# EasyEDA Pro project RCKid.epro, schematic TestBoard

## Sheets
1 Audio: Board Name: TestBoard; Create Date: 2025-06-01; Page Name: Audio; Project Name: rckid; Schematic Name: TestBoard; Update Date: 2025-06-01; Company: EasyEDA.com; Page Size: A4; Version: V1.0
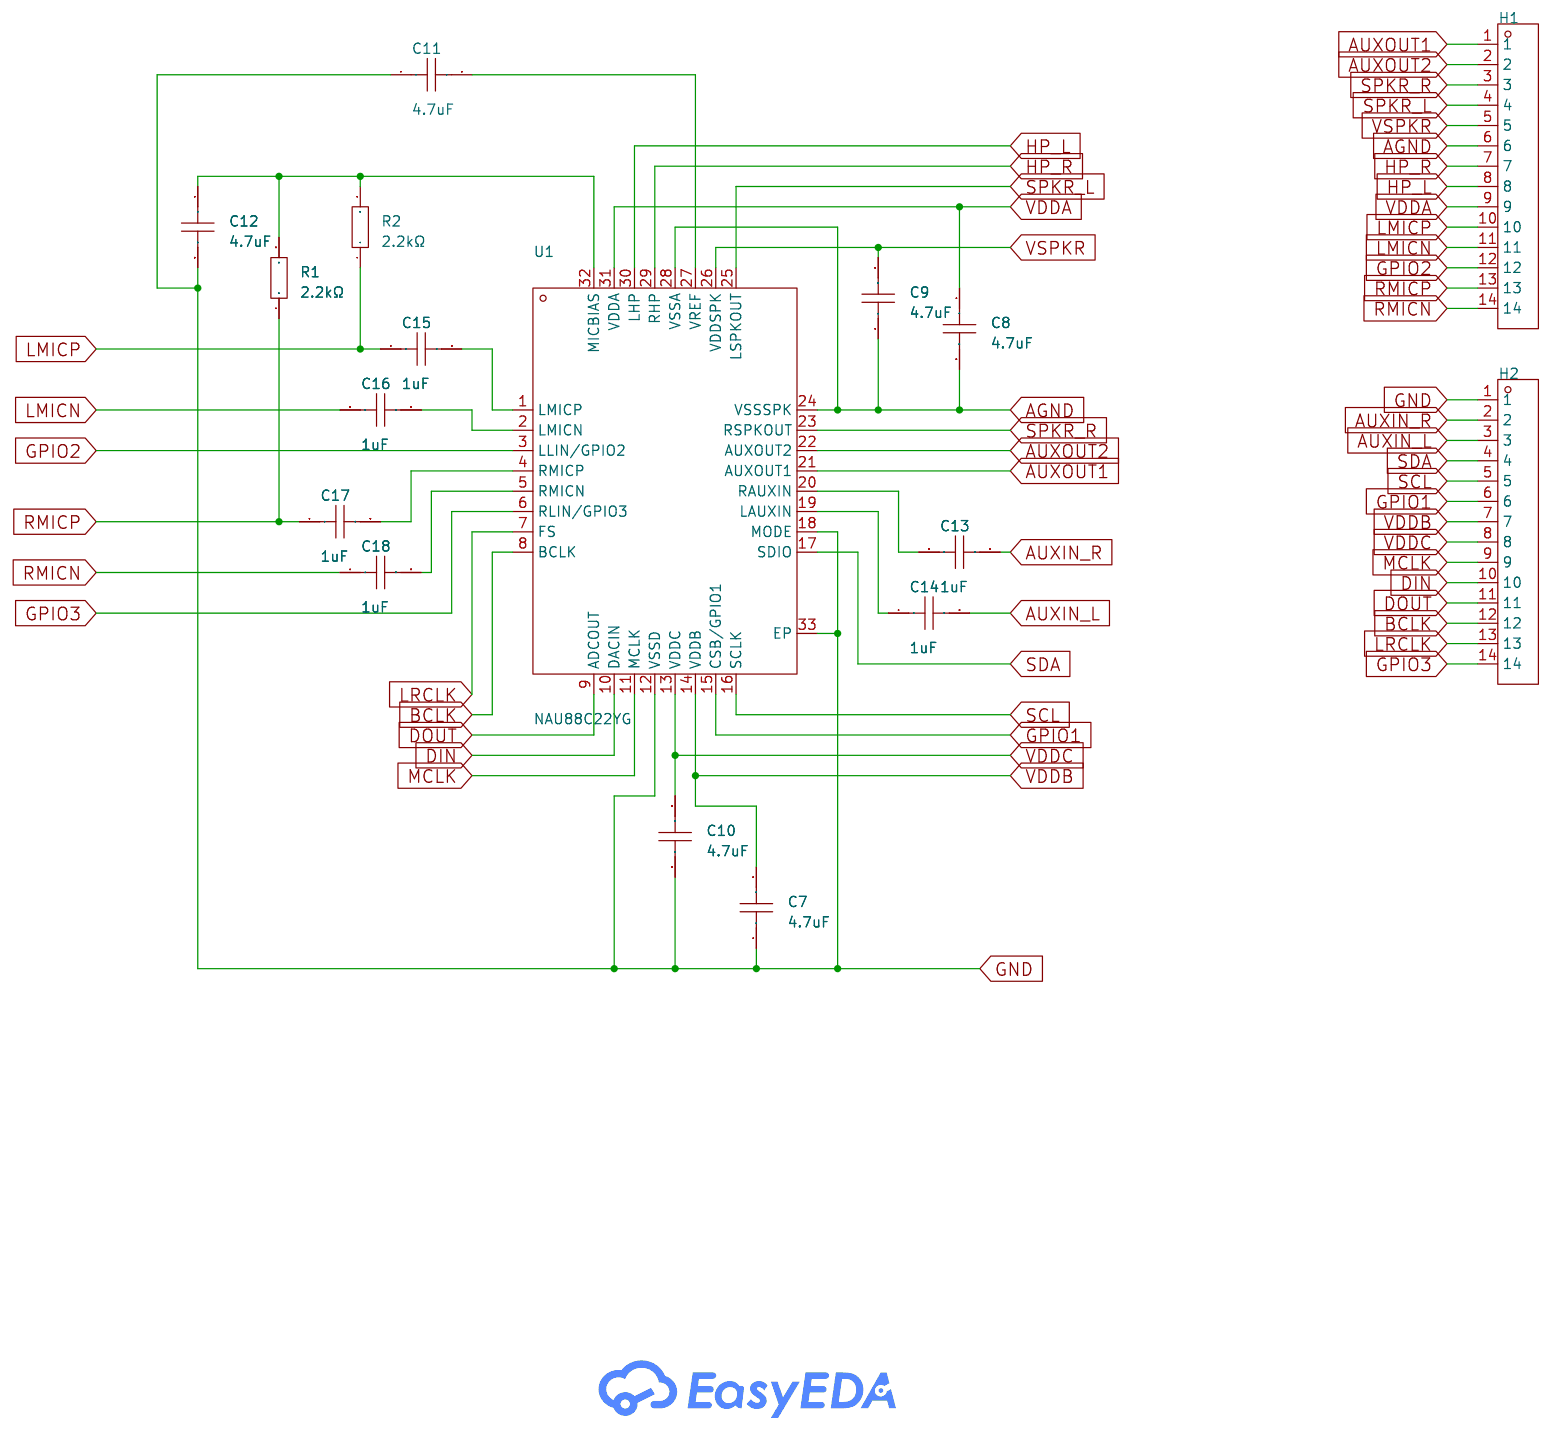
[diagram p9: Audio]
2 PMIC: Page Name: PMIC
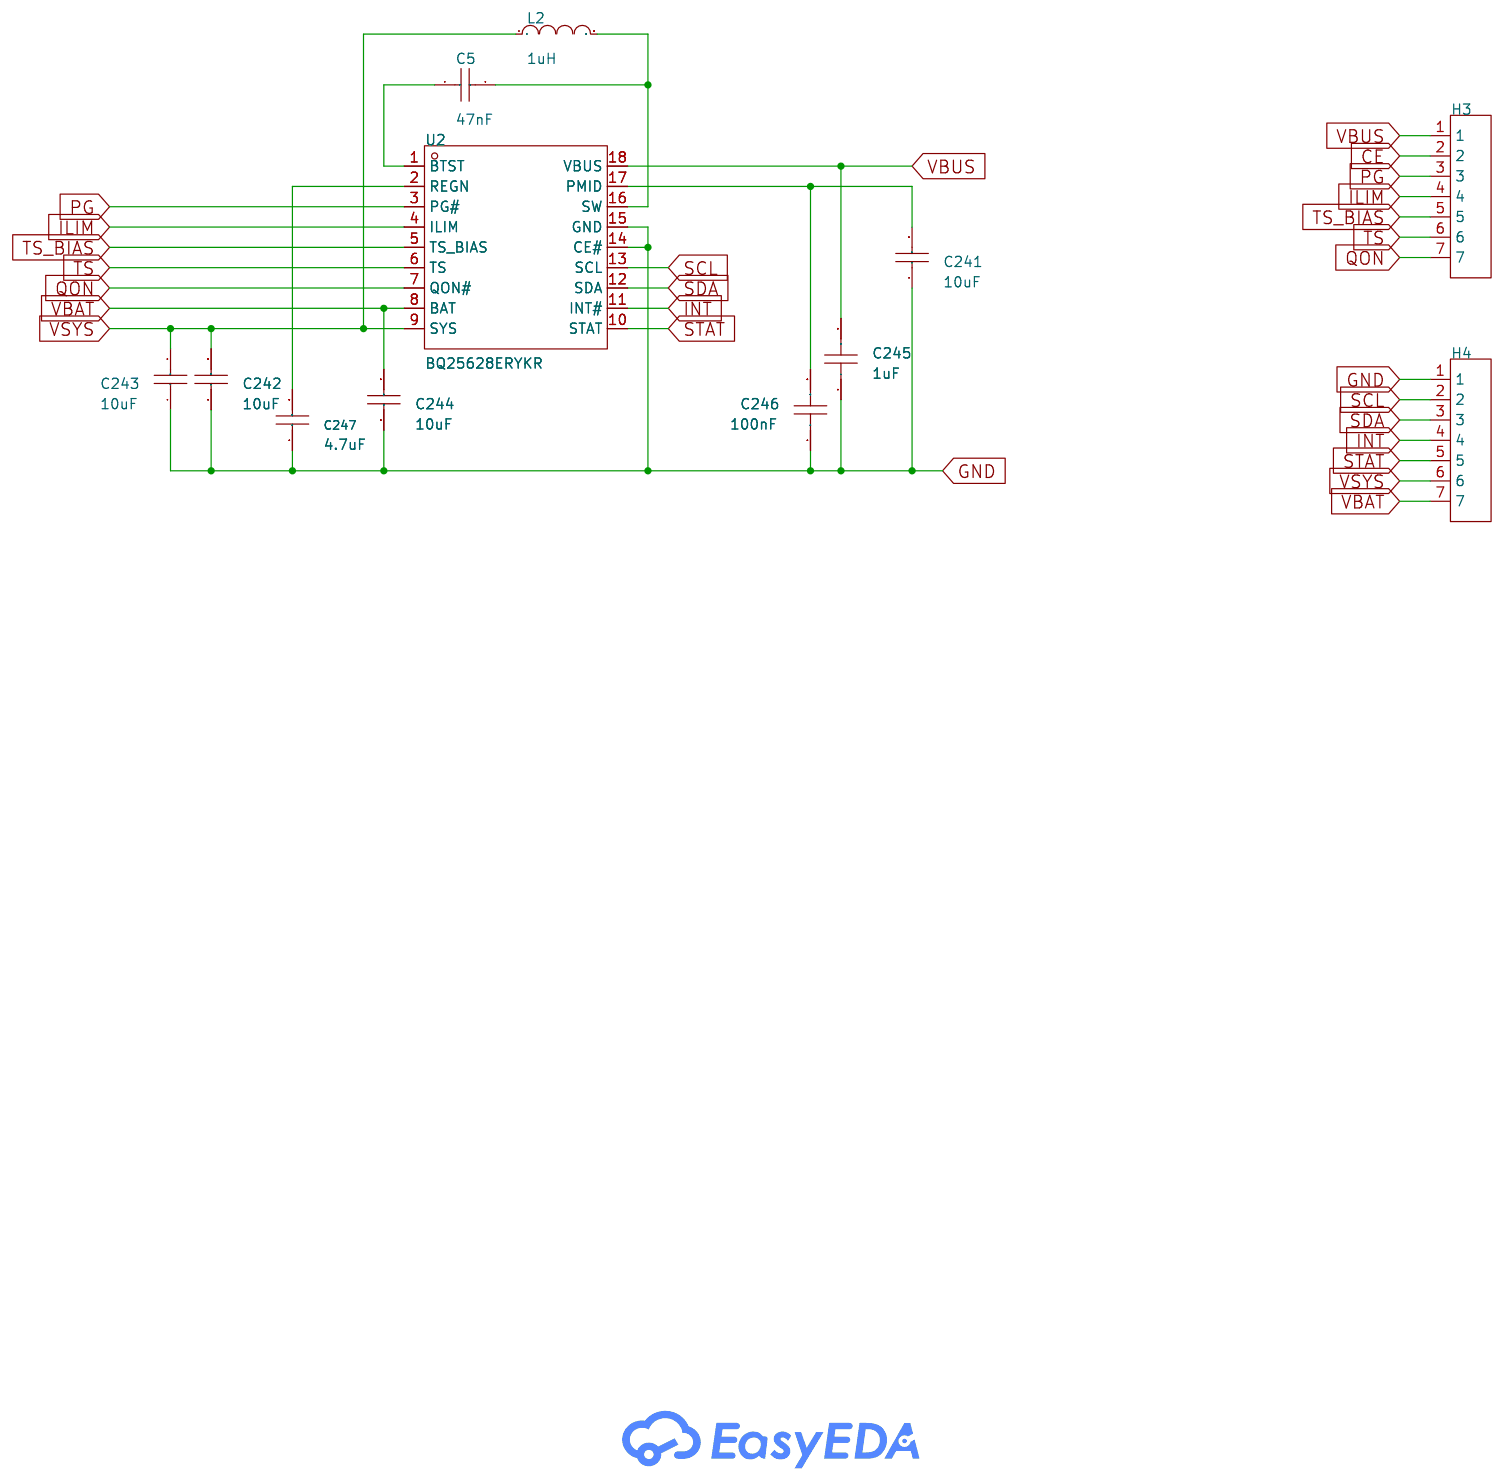
[diagram p10: PMIC]
3 Radio: Page Name: Radio
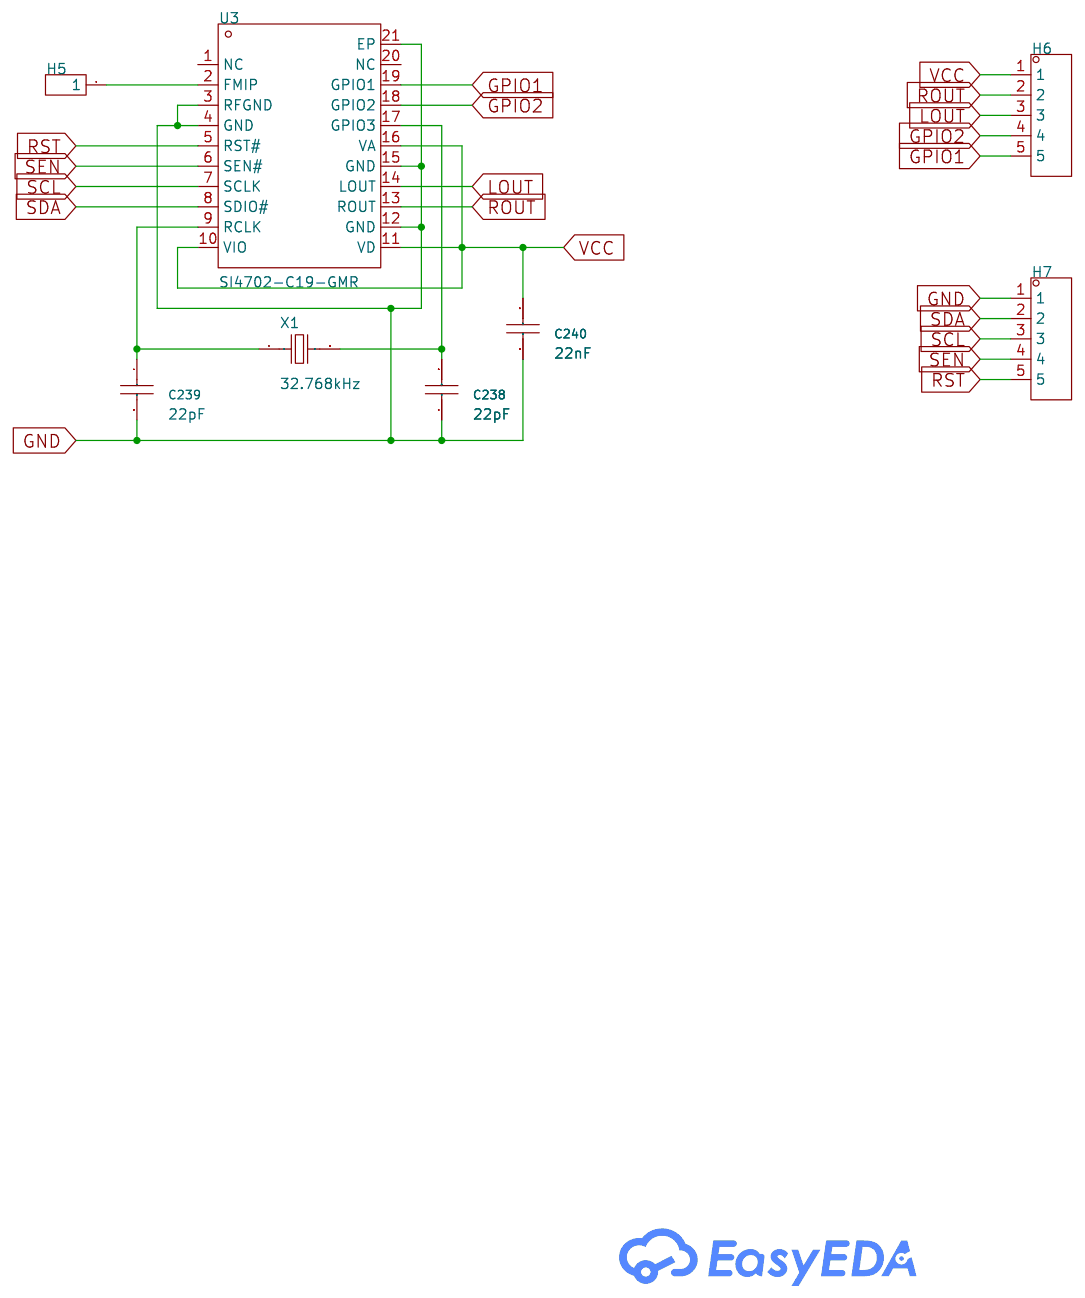
[diagram p11: Radio]
4 FPC: Page Name: FPC
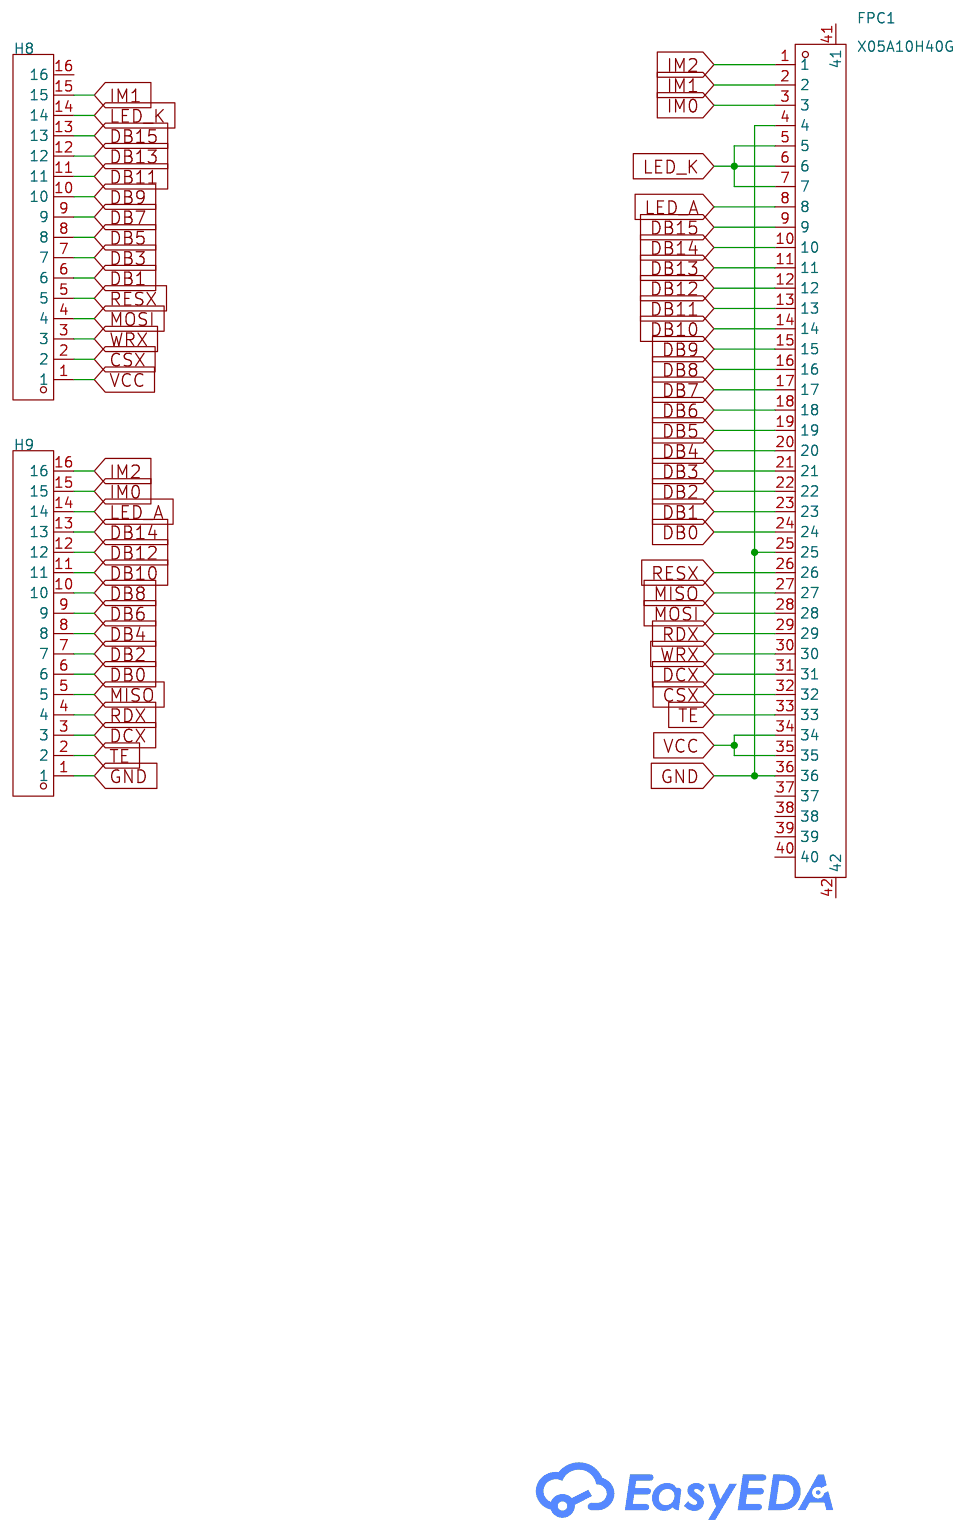
[diagram p12: FPC]

## Parts
sheet Audio
C7  4.7uF  [C0603]
C8  4.7uF  [C0603]
C9  4.7uF  [C0603]
C10  4.7uF  [C0603]
C11  4.7uF  [C0603]
C12  4.7uF  [C0603]
C13  1uF  [C0603]
C14  1uF  [C0603]
C15  1uF  [C0603]
C16  1uF  [C0603]
C17  1uF  [C0603]
C18  1uF  [C0603]
H1  -  [HDR-TH_14P-P2.54-V-M]
H2  -  [HDR-TH_14P-P2.54-V-M]
R1  2.2kΩ  [R0805]
R2  2.2kΩ  [R0805]
U1  NAU88C22YG  [QFN-32_L5.0-W5.0-P0.50-BL-EP2.7]
sheet FPC
FPC1  X05A10H40G  [FPC-SMD_X05A10H40G]
H8  -  [HDR-TH_16P-P2.54-V-M]
H9  -  [HDR-TH_16P-P2.54-V-M]
sheet PMIC
C5  47nF  [C0603]
C241  10uF  [C0402]
C242  10uF  [C0402]
C243  10uF  [C0402]
C244  10uF  [C0402]
C245  1uF  [C0402]
C246  100nF  [C0402]
C247  4.7uF  [C0402]
H3  -  [HDR-TH_7P-P2.54-V-M]
H4  -  [HDR-TH_7P-P2.54-V-M]
L2  1uH  [IND-SMD_L3.0-W3.0_NR3010]
U2  BQ25628ERYKR  [WQFN-18_L3.0-W2.5-P0.40-TL_TI_RYK]
sheet Radio
C238  22pF  [C0805]
C239  22pF  [C0805]
C240  22nF  [C0603]
H5  -  [HDR-TH_1P-V-M_XKB_X4611WV-01I-C28D40]
H6  -  [HDR-TH_5P-P2.54-V-M]
H7  -  [HDR-TH_5P-P2.54-V-M]
U3  SI4702-C19-GMR  [QFN-20_L3.0-W3.0-P0.50-BL-EP1.7_SI470XX-XXX]
X1  32.768kHz  [FC-135R_L3.2-W1.5]

## Library data of the parts
C7-C12 = CL10A475KO8NNNC: Capacitance: Tolerance:±10% Tolerance:±10% Voltage Rated: Temperature Coefficient:; LCSC Part Name: 4.7uF ±10% 16V; Supplier Part: C19666; Manufacturer: SAMSUNG(三星); Supplier Footprint: 0603; JLCPCB Part Class: Basic Part; Datasheet: https://atta.szlcsc.com/upload/public/pdf/source/20160218/1457707763339.pdf; Supplier: LCSC; Tolerance: ±10%
C13-C18 = CL10A105KB8NNNC: Capacitance: Tolerance:±10% Tolerance:±10% Voltage Rated: Temperature Coefficient:; LCSC Part Name: 1uF ±10% 50V; Supplier Part: C15849; Manufacturer: SAMSUNG(三星); Supplier Footprint: 0603; JLCPCB Part Class: Basic Part; Datasheet: https://atta.szlcsc.com/upload/public/pdf/source/20160218/1457707763339.pdf; Supplier: LCSC; Tolerance: ±10%
H1 H2 = HDR-M_2.54_1x14P: Supplier Footprint: Through
R1 R2 = 0805W8F2201T5E_C17520: Type:Thick Film Resistors Resistance:2.2kΩ Tolerance:±1% Tolerance:±1% Power(Watts): Overload Voltage (Max): Temperature Coefficient:±100ppm/℃ Temperature Coefficient:±100ppm/℃ Operating Temperature Range:-55℃~+155℃ Operating Temperature Range:-55℃~+155℃; LCSC Part Name: 2.2kΩ ±1% 125mW 厚膜电阻; Supplier Part: C17520; Manufacturer: UNI-ROYAL(厚声); Manufacturer Part: 0805W8F2201T5E; Supplier Footprint: 0805; JLCPCB Part Class: Basic Part; Datasheet: https://atta.szlcsc.com/upload/public/pdf/source/20200306/C422600_1E6D84923E4A46A82E41ADD87F860B5C.pdf; Supplier: LCSC; Type: Thick Film Resistors; Tolerance: ±1%; Temperature Coefficient: ±100ppm/℃; Operating Temperature Range: -55℃~+155℃
U1 = NAU88C22YG_C914209: LCSC Part Name: 24-bit Stereo Audio Codec with Speaker Driver; Supplier Part: C914209; Manufacturer: NUVOTON(新唐); Supplier Footprint: QFN-32-EP(5x5); JLCPCB Part Class: Extended Part; Datasheet: https://atta.szlcsc.com/upload/public/pdf/source/20170606/1496716392241.pdf; Supplier: LCSC
FPC1 = X05A10H40G: Locking Feature:Clamshell Contact Type:Double-sided contacts/up and down connection Number of Contacts:40P Pitch:0.5mm Mounting Type:卧贴 FFC, FCB Thickness:0.3mm FFC, FCB Thickness:0.3mm Height Above Board:1mm Contact Material:Phosphor bronze Contact Plati; LCSC Part Name: 间距:0.5mm P数:40P 翻盖式 双侧触点/上下接; Supplier Part: C528037; Manufacturer: XKB Connection(中国星坤); Supplier Footprint: SMD,P=0.5mm,卧贴; JLCPCB Part Class: Extended Part; Datasheet: https://atta.szlcsc.com/upload/public/pdf/source/20211011/0FF349E115430A192F511B573FCEF693.pdf; Supplier: LCSC; Locking Feature: Clamshell; Contact Type: Double-sided contacts/up and down connection; Number of Contacts: 40P; Pitch: 0.5mm; Mounting Type: 卧贴; FFC, FCB Thickness: 0.3mm; Height Above Board: 1mm; Contact Material: Phosphor bronze; Contact Plating: Gold; Operating Temperature Range: -40℃~+85℃; Soldering Temperature(Max): 260℃
H8 H9 = HDR-M_2.54_1x16P: Supplier Footprint: Through
C5 = CL10B473KB8NNNC: Capacitance: Tolerance:±10% Tolerance:±10% Voltage Rated: Temperature Coefficient:; LCSC Part Name: 47nF±10%50V; Supplier Part: C1622; Manufacturer: SAMSUNG(三星); Supplier Footprint: 0603; JLCPCB Part Class: BasicPart; Datasheet: https://atta.szlcsc.com/upload/public/pdf/source/20160103/1457707684971.pdf; Supplier: LCSC; Tolerance: ±10%
C241-C244 = CL05A106MQ5NUNC: Capacitance: Tolerance:±20% Tolerance:±20% Voltage Rated: Temperature Coefficient:; LCSC Part Name: 10uF±20%6.3V; Supplier Part: C15525; Manufacturer: SAMSUNG(三星); Supplier Footprint: 0402; JLCPCB Part Class: BasicPart; Datasheet: https://atta.szlcsc.com/upload/public/pdf/source/20220823/2B02EE04F8F211D38A52DCB16EB6BEBA.pdf; Supplier: LCSC; Tolerance: ±20%
C245 = CL05A105KA5NQNC: Capacitance: Tolerance:±10% Tolerance:±10% Voltage Rated: Temperature Coefficient:; LCSC Part Name: 1uF±10%25V; Supplier Part: C52923; Manufacturer: SAMSUNG(三星); Supplier Footprint: 0402; JLCPCB Part Class: BasicPart; Datasheet: https://atta.szlcsc.com/upload/public/pdf/source/20160103/1457707735223.pdf; Supplier: LCSC; Tolerance: ±10%
C246 = CL05B104KB54PNC: Capacitance: Tolerance:±10% Tolerance:±10% Voltage Rated: Temperature Coefficient:; LCSC Part Name: 100nF ±10% 50V; Supplier Part: C307331; Manufacturer: SAMSUNG(三星); Supplier Footprint: 0402; JLCPCB Part Class: Basic Part; Datasheet: https://atta.szlcsc.com/upload/public/pdf/source/20181009/C307331_222F7C870FD3EA5F46F538B483443886.pdf; Supplier: LCSC; Tolerance: ±10%
C247 = CL05A475MP5NRNC: Capacitance: Tolerance:±20% Tolerance:±20% Voltage Rated: Temperature Coefficient:; LCSC Part Name: 4.7uF±20%10V; Supplier Part: C23733; Manufacturer: SAMSUNG(三星); Supplier Footprint: 0402; JLCPCB Part Class: BasicPart; Datasheet: https://atta.szlcsc.com/upload/public/pdf/source/20160103/1457707710457.pdf; Supplier: LCSC; Tolerance: ±20%
H3 H4 = HDR-M_2.54_1x7P: Supplier Footprint: Through
L2 = NR3015T1R0N: Inductance: Tolerance:±30% Tolerance:±30% Rated Current: Saturation Current (Isat):2.1A DC Resistance (DCR): Type:- Ratings:-; LCSC Part Name: 1uH ±30% 2.1A; Supplier Part: C92931; Manufacturer: TAIYO YUDEN(太诱); Supplier Footprint: SMD,3x3mm; JLCPCB Part Class: Extended Part; Datasheet: https://atta.szlcsc.com/upload/public/pdf/source/20210429/D283EEC4B2B32E0C06ACD7E308182B38.pdf; Supplier: LCSC; Tolerance: ±30%; Saturation Current (Isat): 2.1A
U2 = BQ25628ERYKR: Supplier Part: C9900060801; Supplier Footprint: WQFN-HR; Supplier: LCSC
C238 C239 = CL21C220JBANNNC: Capacitance: Tolerance:±5% Tolerance:±5% Voltage Rated: Temperature Coefficient:; LCSC Part Name: 22pF ±5% 50V; Supplier Part: C1804; Manufacturer: SAMSUNG(三星); Supplier Footprint: 0805; JLCPCB Part Class: Basic Part; Datasheet: https://atta.szlcsc.com/upload/public/pdf/source/20160218/1457707763339.pdf; Supplier: LCSC; Tolerance: ±5%
C240 = CL10B223KB8NNNC: Capacitance: Tolerance:±10% Tolerance:±10% Voltage Rated: Temperature Coefficient:; LCSC Part Name: 22nF ±10% 50V; Supplier Part: C21122; Manufacturer: SAMSUNG(三星); Supplier Footprint: 0603; JLCPCB Part Class: Basic Part; Datasheet: https://atta.szlcsc.com/upload/public/pdf/source/20160218/1457707763339.pdf; Supplier: LCSC; Tolerance: ±10%
H5 = HDR-M_2.54_1x1P: Supplier Footprint: Through
H6 H7 = HDR-M_2.54_1x5P: Supplier Footprint: Through
U3 = SI4702-C19-GMR: Frequency Range:76MHz~108MHz Frequency Range:76MHz~108MHz Interface:I2C；UART；SPI Voltage - Supply:2.7V~5.5V Voltage - Supply:2.7V~5.5V Applications:FM Typical Application Frequency:87.5MHz Operating Temperature:-20℃~+85℃ Operating Temperature:-20℃~+85℃; LCSC Part Name: 用于FM广播无线电接收 集成从天线输入到立体声音频输出的调谐器功能; Supplier Part: C2155666; Manufacturer: SKYWORKS/SILICON LABS(芯科); Supplier Footprint: QFN-20-EP(3x3); JLCPCB Part Class: Extended Part; Datasheet: https://atta.szlcsc.com/upload/public/pdf/source/20210612/38E2A75F208C2067F53EF9EACE84D5AD.pdf; Supplier: LCSC; Frequency Range: 76MHz~108MHz; Interface: I2C；UART；SPI; Voltage - Supply: 2.7V~5.5V; Applications: FM; Typical Application Frequency: 87.5MHz; Operating Temperature: -20℃~+85℃
X1 = Q13FC13500004_C32346: Crystal Type:Surface Mount Crystal Frequency: Normal temperature Frequency Tolerance:±20ppm Normal temperature Frequency Tolerance:±20ppm Load Capacitor: Equivalent Series Resistance (ESR):70kΩ Operating Temperature: Operating Temperature:; LCSC Part Name: 32.768kHz ±20ppm 12.5pF; Supplier Part: C32346; Manufacturer: EPSON(爱普生); Manufacturer Part: Q13FC13500004; Supplier Footprint: SMD3215-2P; JLCPCB Part Class: Basic Part; Datasheet: https://atta.szlcsc.com/upload/public/pdf/source/20240418/0E0FF5F0356BA3753F616001439D1416.pdf; Supplier: LCSC; Crystal Type: Surface Mount Crystal; Normal temperature Frequency Tolerance: ±20ppm; Equivalent Series Resistance (ESR): 70kΩ

## Nets
AGND: C8.2 C9.1 H1.6 U1.24(VSSSPK) U1.28(VSSA)
GND: C7.1 C10.1 C11.1 C12.2 C238.1 C239.2 C240.1 C241.1 C242.1 C243.1 C244.1 C245.1 C246.1 C247.1 FPC1.4 FPC1.25 FPC1.36 H2.1 H4.1 H7.1 H9.1 U1.12(VSSD) U1.18(MODE) U1.33(EP) U2.14(CE#) U2.15(GND) U3.3(RFGND) U3.4(GND) U3.12(GND) U3.15(GND) U3.21(EP)
VBAT: C244.2 H4.7 U2.8(BAT)
VBUS: C245.2 H3.1 U2.18(VBUS)
VCC: C240.2 FPC1.34 FPC1.35 H6.1 H8.1 U3.10(VIO) U3.11(VD) U3.16(VA)
VDDA: C8.1 H1.9 U1.31(VDDA)
VDDB: C7.2 H2.7 U1.14(VDDB)
VDDC: C10.2 H2.8 U1.13(VDDC)
AUXIN_L: C14.2 H2.3
AUXIN_R: C13.2 H2.2
AUXOUT1: H1.1 U1.21(AUXOUT1)
AUXOUT2: H1.2 U1.22(AUXOUT2)
BCLK: H2.12 U1.8(BCLK)
CE: H3.2
CSX: FPC1.32 H8.2
DB0: FPC1.24 H9.6
DB1: FPC1.23 H8.6
DB2: FPC1.22 H9.7
DB3: FPC1.21 H8.7
DB4: FPC1.20 H9.8
DB5: FPC1.19 H8.8
DB6: FPC1.18 H9.9
DB7: FPC1.17 H8.9
DB8: FPC1.16 H9.10
DB9: FPC1.15 H8.10
DB10: FPC1.14 H9.11
DB11: FPC1.13 H8.11
DB12: FPC1.12 H9.12
DB13: FPC1.11 H8.12
DB14: FPC1.10 H9.13
DB15: FPC1.9 H8.13
DCX: FPC1.31 H9.3
DIN: H2.10 U1.10(DACIN)
DOUT: H2.11 U1.9(ADCOUT)
GPIO1: H2.6 H6.5 U1.15(CSB/GPIO1) U3.19(GPIO1)
GPIO2: H1.12 H6.4 U1.3(LLIN/GPIO2) U3.18(GPIO2)
GPIO3: H2.14 U1.6(RLIN/GPIO3)
HP_L: H1.8 U1.30(LHP)
HP_R: H1.7 U1.29(RHP)
ILIM: H3.4 U2.4(ILIM)
IM0: FPC1.3 H9.15
IM1: FPC1.2 H8.15
IM2: FPC1.1 H9.16
INT: H4.4 U2.11(INT#)
LED_A: FPC1.8 H9.14
LED_K: FPC1.5 FPC1.6 FPC1.7 H8.14
LMICN: C16.1 H1.11
LMICP: C15.1 H1.10 R2.1
LOUT: H6.3 U3.14(LOUT)
LRCLK: H2.13 U1.7(FS)
MCLK: H2.9 U1.11(MCLK)
MISO: FPC1.27 H9.5
MOSI: FPC1.28 H8.4
PG: H3.3 U2.3(PG#)
QON: H3.7 U2.7(QON#)
RDX: FPC1.29 H9.4
RESX: FPC1.26 H8.5
RMICN: C18.1 H1.14
RMICP: C17.1 H1.13 R1.1
ROUT: H6.2 U3.13(ROUT)
RST: H7.5 U3.5(RST#)
SCL: H2.5 H4.2 H7.3 U1.16(SCLK) U2.13(SCL) U3.7(SCLK)
SDA: H2.4 H4.3 H7.2 U1.17(SDIO) U2.12(SDA) U3.8(SDIO#)
SEN: H7.4 U3.6(SEN#)
SPKR_L: H1.4 U1.25(LSPKOUT)
SPKR_R: H1.3 U1.23(RSPKOUT)
STAT: H4.5 U2.10(STAT)
TE: FPC1.33 H9.2
TS: H3.6 U2.6(TS)
TS_BIAS: H3.5 U2.5(TS_BIAS)
VSPKR: C9.2 H1.5 U1.26(VDDSPK)
VSYS: C242.2 C243.2 H4.6 L2.1 U2.9(SYS)
WRX: FPC1.30 H8.3
$1N1172: C13.1 U1.20(RAUXIN)
$1N1178: C14.1 U1.19(LAUXIN)
$1N1197: C11.2 U1.27(VREF)
$1N1203: C12.1 R1.2 R2.2 U1.32(MICBIAS)
$1N1221: C18.2 U1.5(RMICN)
$1N1237: C17.2 U1.4(RMICP)
$1N1247: C15.2 U1.1(LMICP)
$1N1254: C16.2 U1.2(LMICN)
$2N763: C241.2 C246.2 U2.17(PMID)
$2N779: C5.2 L2.2 U2.16(SW)
$2N785: C5.1 U2.1(BTST)
$2N832: C247.2 U2.2(REGN)
$3N389: C239.1 U3.9(RCLK) X1.1
$3N395: C238.2 U3.17(GPIO3) X1.2
$3N930: H5.1 U3.2(FMIP)

Not connected (* = marked no-connect by the designer): FPC1 37 38 39 40 41 42; H8 16; U3 1(NC) 20(NC)
